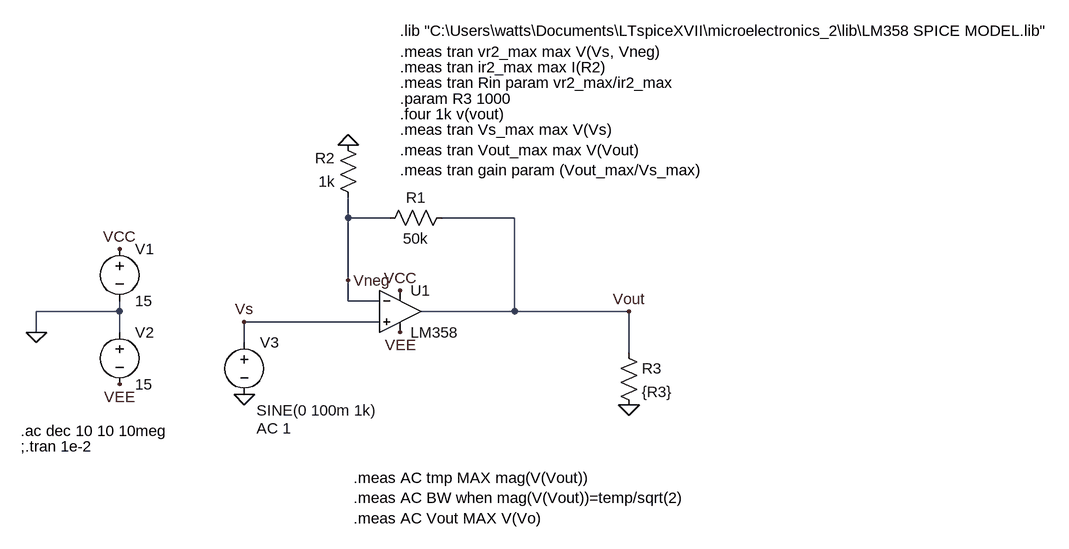
[diagram p0: schematic op_amp_non_inverting.asc]
op_amp_non_inverting.asc, the LTspice schematic file:
Version 4
SHEET 1 1376 808
WIRE 176 160 176 128
WIRE 240 160 176 160
WIRE 432 160 320 160
WIRE 176 256 176 160
WIRE 176 288 176 256
WIRE 224 288 176 288
WIRE -176 304 -176 288
WIRE -176 304 -304 304
WIRE 432 304 432 160
WIRE 432 304 288 304
WIRE 608 304 432 304
WIRE 224 320 16 320
WIRE -304 336 -304 304
WIRE -176 336 -176 304
WIRE 16 352 16 320
WIRE 608 368 608 304
FLAG -304 336 0
FLAG -176 208 VCC
FLAG -176 416 VEE
FLAG 256 272 VCC
FLAG 256 336 VEE
FLAG 16 432 0
FLAG 176 48 0
FLAG 608 448 0
FLAG 608 304 Vout
FLAG 16 320 Vs
FLAG 176 256 Vneg
SYMBOL OpAmps\\opamp2 256 240 R0
SYMATTR InstName U1
SYMATTR Value LM358
SYMBOL res 336 144 R90
WINDOW 0 0 56 VBottom 2
WINDOW 3 32 56 VTop 2
SYMATTR InstName R1
SYMATTR Value 50k
SYMBOL res 192 144 R180
WINDOW 0 36 76 Left 2
WINDOW 3 36 40 Left 2
SYMATTR InstName R2
SYMATTR Value 1k
SYMBOL voltage -176 192 R0
WINDOW 123 0 0 Left 0
WINDOW 39 0 0 Left 0
SYMATTR InstName V1
SYMATTR Value 15
SYMBOL voltage -176 320 R0
WINDOW 123 0 0 Left 0
WINDOW 39 0 0 Left 0
SYMATTR InstName V2
SYMATTR Value 15
SYMBOL voltage 16 336 R0
WINDOW 123 19 148 Left 2
WINDOW 39 0 0 Left 0
WINDOW 3 19 120 Left 2
SYMATTR Value2 AC 1
SYMATTR Value SINE(0 100m 1k)
SYMATTR InstName V3
SYMBOL res 592 352 R0
SYMATTR InstName R3
SYMATTR Value {R3}
TEXT 256 -128 Left 2 !.lib "C:\\Users\\watts\\Documents\\LTspiceXVII\\microelectronics_2\\lib\\LM358 SPICE MODEL.lib"
TEXT -328 512 Left 2 !;.tran 1e-2
TEXT 256 -96 Left 2 !.meas tran vr2_max max V(Vs, Vneg)
TEXT 256 -72 Left 2 !.meas tran ir2_max max I(R2)
TEXT 256 -48 Left 2 !.meas tran Rin param vr2_max/ir2_max
TEXT 256 0 Left 2 !.four 1k v(vout)
TEXT 256 -24 Left 2 !.param R3 1000
TEXT -328 488 Left 2 !.ac dec 10 10 10meg
TEXT 256 24 Left 2 !.meas tran Vs_max max V(Vs)\n.meas tran Vout_max max V(Vout)\n.meas tran gain param (Vout_max/Vs_max)
TEXT 184 560 Left 2 !.meas AC tmp MAX mag(V(Vout))\n.meas AC BW when mag(V(Vout))=temp/sqrt(2)\n.meas AC Vout MAX V(Vo)

The netlist it stands for:
* op_amp_non_inverting.asc
XU1 Vs Vneg VCC VEE Vout LM358  ; pins In+ In- V+ V- OUT
R1 Vout Vneg 50k
R2 Vneg 0 1k
V1 VCC 0 15
V2 0 VEE 15
V3 Vs 0 SINE(0 100m 1k) AC 1
R3 Vout 0 {R3}
.lib "C:\Users\watts\Documents\LTspiceXVII\microelectronics_2\lib\LM358 SPICE MODEL.lib"
;.tran 1e-2
.meas tran vr2_max max V(Vs, Vneg)
.meas tran ir2_max max I(R2)
.meas tran Rin param vr2_max/ir2_max
.four 1k v(vout)
.param R3 1000
.ac dec 10 10 10meg
.meas tran Vs_max max V(Vs)
.meas tran Vout_max max V(Vout)
.meas tran gain param (Vout_max/Vs_max)
.meas AC tmp MAX mag(V(Vout))
.meas AC BW when mag(V(Vout))=temp/sqrt(2)
.meas AC Vout MAX V(Vo)
.backanno
.end